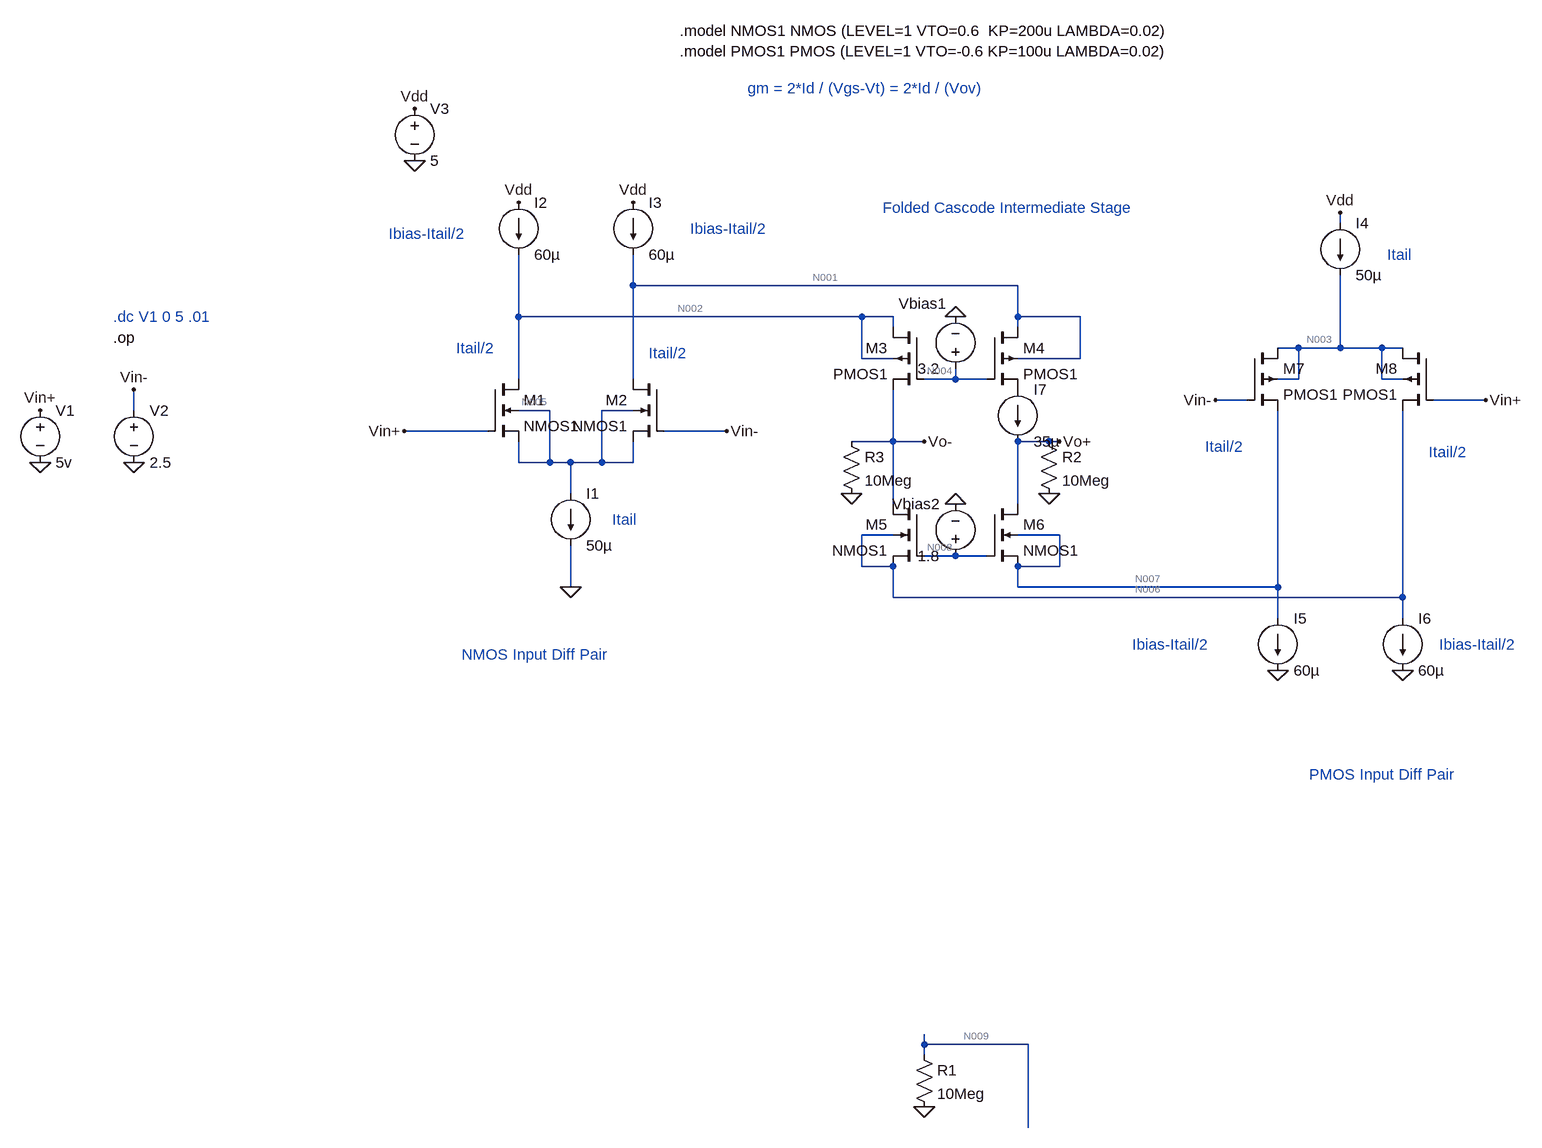
[diagram p0: schematic Mosfet_rail_to_rail_thanksgiving.asc]
Mosfet_rail_to_rail_thanksgiving.asc, the LTspice schematic file:
Version 4.1
SHEET 1 1728 1628
WIRE 1312 -128 1312 -144
WIRE 224 -32 224 -80
WIRE 816 -32 224 -32
WIRE 48 16 48 -80
WIRE 576 16 48 16
WIRE 624 16 576 16
WIRE 816 16 816 -32
WIRE 912 16 816 16
WIRE 624 32 624 16
WIRE 816 32 816 16
WIRE 1248 64 1216 64
WIRE 1312 64 1312 -48
WIRE 1312 64 1248 64
WIRE 1376 64 1312 64
WIRE 1408 64 1376 64
WIRE 576 80 576 16
WIRE 624 80 576 80
WIRE 912 80 912 16
WIRE 912 80 816 80
WIRE 48 112 48 16
WIRE 224 112 224 -32
WIRE 720 112 720 96
WIRE 720 112 672 112
WIRE 768 112 720 112
WIRE 1248 112 1248 64
WIRE 1248 112 1216 112
WIRE 1376 112 1376 64
WIRE 1408 112 1376 112
WIRE 1168 144 1120 144
WIRE 1536 144 1456 144
WIRE -544 160 -544 128
WIRE 96 160 48 160
WIRE 224 160 176 160
WIRE 0 192 -128 192
WIRE 368 192 272 192
WIRE 624 208 624 128
WIRE 624 208 560 208
WIRE 672 208 624 208
WIRE 864 208 816 208
WIRE 880 208 864 208
WIRE 48 240 48 208
WIRE 96 240 96 160
WIRE 96 240 48 240
WIRE 128 240 96 240
WIRE 176 240 176 160
WIRE 176 240 128 240
WIRE 224 240 224 208
WIRE 224 240 176 240
WIRE 128 288 128 240
WIRE 624 304 624 208
WIRE 816 304 816 208
WIRE 624 352 576 352
WIRE 880 352 816 352
WIRE 720 384 672 384
WIRE 768 384 720 384
WIRE 576 400 576 352
WIRE 624 400 576 400
WIRE 880 400 880 352
WIRE 880 400 816 400
WIRE 128 432 128 368
WIRE 816 432 816 400
WIRE 1216 432 1216 160
WIRE 1216 432 816 432
WIRE 624 448 624 400
WIRE 1408 448 1408 160
WIRE 1408 448 624 448
WIRE 1216 480 1216 432
WIRE 1408 480 1408 448
WIRE 672 1136 672 1120
WIRE 832 1136 672 1136
WIRE 672 1152 672 1136
WIRE 832 1264 832 1136
FLAG 128 432 0
FLAG 1216 560 0
FLAG 1408 560 0
FLAG 1536 144 Vin+
FLAG -128 192 Vin+
FLAG 368 192 Vin-
FLAG 1120 144 Vin-
FLAG 720 16 0
FLAG 720 304 0
FLAG -112 -224 0
FLAG -112 -304 Vdd
FLAG 48 -160 Vdd
FLAG 224 -160 Vdd
FLAG 1312 -144 Vdd
FLAG 880 208 Vo+
FLAG -688 240 0
FLAG -688 160 Vin+
FLAG -544 240 0
FLAG -544 128 Vin-
FLAG 672 208 Vo-
FLAG 672 1232 0
FLAG 864 288 0
FLAG 560 288 0
DATAFLAG 1216 272 ""
DATAFLAG 1312 0 ""
DATAFLAG 1408 288 ""
DATAFLAG 400 -32 ""
DATAFLAG 80 16 ""
DATAFLAG 128 272 ""
DATAFLAG 848 208 ""
DATAFLAG 640 208 ""
DATAFLAG 336 192 ""
DATAFLAG -96 192 ""
DATAFLAG 768 1136 ""
SYMBOL nmos4 0 112 R0
SYMATTR InstName M1
SYMATTR Value NMOS1
SYMATTR Value2 l=300n w=300n
SYMBOL nmos4 272 112 M0
SYMATTR InstName M2
SYMATTR Value NMOS1
SYMATTR Value2 l=300n w=300n
SYMBOL current 128 288 R0
WINDOW 123 0 0 Left 0
WINDOW 39 0 0 Left 0
SYMATTR InstName I1
SYMATTR Value 50µ
SYMBOL current 48 -160 R0
WINDOW 123 0 0 Left 0
WINDOW 39 0 0 Left 0
SYMATTR InstName I2
SYMATTR Value 60µ
SYMBOL current 224 -160 R0
WINDOW 123 0 0 Left 0
WINDOW 39 0 0 Left 0
SYMATTR InstName I3
SYMATTR Value 60µ
SYMBOL pmos4 672 32 M0
SYMATTR InstName M3
SYMATTR Value PMOS1
SYMATTR Value2 l=300n w=600n
SYMBOL pmos4 768 32 R0
SYMATTR InstName M4
SYMATTR Value PMOS1
SYMATTR Value2 l=300n w=600n
SYMBOL nmos4 672 304 M0
SYMATTR InstName M5
SYMATTR Value NMOS1
SYMATTR Value2 l=300n w=300n
SYMBOL nmos4 768 304 R0
SYMATTR InstName M6
SYMATTR Value NMOS1
SYMATTR Value2 l=300n w=300n
SYMBOL pmos4 1168 64 R0
SYMATTR InstName M7
SYMATTR Value PMOS1
SYMATTR Value2 l=300n w=600n
SYMBOL pmos4 1456 64 M0
SYMATTR InstName M8
SYMATTR Value PMOS1
SYMATTR Value2 l=300n w=600n
SYMBOL current 1312 -128 R0
WINDOW 123 0 0 Left 0
WINDOW 39 0 0 Left 0
SYMATTR InstName I4
SYMATTR Value 50µ
SYMBOL current 1216 480 R0
WINDOW 123 0 0 Left 0
WINDOW 39 0 0 Left 0
SYMATTR InstName I5
SYMATTR Value 60µ
SYMBOL current 1408 480 R0
WINDOW 123 0 0 Left 0
WINDOW 39 0 0 Left 0
SYMATTR InstName I6
SYMATTR Value 60µ
SYMBOL voltage 720 112 R180
WINDOW 0 14 116 Left 2
WINDOW 3 24 16 Left 2
WINDOW 123 0 0 Left 0
WINDOW 39 0 0 Left 0
SYMATTR InstName Vbias1
SYMATTR Value 3.2
SYMBOL voltage 720 400 R180
WINDOW 0 24 96 Left 2
WINDOW 3 24 16 Left 2
WINDOW 123 0 0 Left 0
WINDOW 39 0 0 Left 0
SYMATTR InstName Vbias2
SYMATTR Value 1.8
SYMBOL voltage -112 -320 R0
WINDOW 123 0 0 Left 0
WINDOW 39 0 0 Left 0
SYMATTR InstName V3
SYMATTR Value 5
SYMBOL voltage -688 144 R0
WINDOW 123 0 0 Left 0
WINDOW 39 0 0 Left 0
SYMATTR InstName V1
SYMATTR Value 5v
SYMBOL voltage -544 144 R0
WINDOW 123 0 0 Left 0
WINDOW 39 0 0 Left 0
SYMATTR InstName V2
SYMATTR Value 2.5
SYMBOL res 656 1136 R0
SYMATTR InstName R1
SYMATTR Value 10Meg
SYMBOL res 848 192 R0
SYMATTR InstName R2
SYMATTR Value 10Meg
SYMBOL current 816 128 R0
WINDOW 123 0 0 Left 0
WINDOW 39 0 0 Left 0
SYMATTR InstName I7
SYMATTR Value 35µ
SYMBOL res 544 192 R0
SYMATTR InstName R3
SYMATTR Value 10Meg
TEXT 192 328 Left 2 ;Itail
TEXT -48 64 Left 2 ;Itail/2
TEXT 248 72 Left 2 ;Itail/2
TEXT 1104 216 Left 2 ;Itail/2
TEXT 1448 224 Left 2 ;Itail/2
TEXT 1384 -80 Left 2 ;Itail
TEXT -152 -112 Left 2 ;Ibias-Itail/2
TEXT 312 -120 Left 2 ;Ibias-Itail/2
TEXT 992 520 Left 2 ;Ibias-Itail/2
TEXT 1464 520 Left 2 ;Ibias-Itail/2
TEXT 400 -336 Left 2 ;gm = 2*Id / (Vgs-Vt) = 2*Id / (Vov)
TEXT 296 -424 Left 2 !.model NMOS1 NMOS (LEVEL=1 VTO=0.6  KP=200u LAMBDA=0.02)\n.model PMOS1 PMOS (LEVEL=1 VTO=-0.6 KP=100u LAMBDA=0.02)
TEXT -576 16 Left 2 ;.dc V1 0 5 .01
TEXT -576 48 Left 2 !.op
TEXT -40 536 Left 2 ;NMOS Input Diff Pair
TEXT 1264 720 Left 2 ;PMOS Input Diff Pair
TEXT 608 -152 Left 2 ;Folded Cascode Intermediate Stage

The netlist it stands for:
* Mosfet_rail_to_rail_thanksgiving.asc
M1 N002 Vin+ N005 N005 NMOS1 l=300n w=300n
M2 N001 Vin- N005 N005 NMOS1 l=300n w=300n
I1 N005 0 50µ
I2 Vdd N002 60µ
I3 Vdd N001 60µ
M3 N002 N004 Vo- N002 PMOS1 l=300n w=600n
M4 N001 N004 P001 N001 PMOS1 l=300n w=600n
M5 Vo- N008 N006 N006 NMOS1 l=300n w=300n
M6 Vo+ N008 N007 N007 NMOS1 l=300n w=300n
M7 N003 Vin- N007 N003 PMOS1 l=300n w=600n
M8 N003 Vin+ N006 N003 PMOS1 l=300n w=600n
I4 Vdd N003 50µ
I5 N007 0 60µ
I6 N006 0 60µ
Vbias1 N004 0 3.2
Vbias2 N008 0 1.8
V3 Vdd 0 5
V1 Vin+ 0 5v
V2 Vin- 0 2.5
R1 N009 0 10Meg
R2 Vo+ 0 10Meg
I7 P001 Vo+ 35µ
R3 Vo- 0 10Meg
.model NMOS NMOS
.model PMOS PMOS
.lib standard.mos
* Itail
* Itail/2
* Itail/2
* Itail/2
* Itail/2
* Itail
* Ibias-Itail/2
* Ibias-Itail/2
* Ibias-Itail/2
* Ibias-Itail/2
* gm = 2*Id / (Vgs-Vt) = 2*Id / (Vov)
.model NMOS1 NMOS (LEVEL=1 VTO=0.6  KP=200u LAMBDA=0.02)
.model PMOS1 PMOS (LEVEL=1 VTO=-0.6 KP=100u LAMBDA=0.02)
* .dc V1 0 5 .01
.op
* NMOS Input Diff Pair
* PMOS Input Diff Pair
* Folded Cascode Intermediate Stage
.backanno
.end

* Results of the author's LTspice run, read from the files saved beside the schematic
* Operating Point:
*   V(n001) = 13.74 MV
*   V(n002) = 4.059 V
*   V(n003) = 3.789 V
*   V(n004) = 3.2 V
*   V(n005) = 3.817 V
*   V(n006) = -225.1 V
*   V(n007) = 1.071 V
*   V(n008) = 1.8 V
*   V(n009) = 0 V
*   V(p001) = 13.74 MV
*   V(vdd) = 5 V
*   V(vin+) = 5 V
*   V(vin-) = 2.5 V
*   V(vo+) = 250 V
*   V(vo-) = -225.1 V
*   I(I1) = 50 µA
*   I(I2) = 60 µA
*   I(I3) = 60 µA
*   I(I4) = 50 µA
*   I(I5) = 60 µA
*   I(I6) = 60 µA
*   I(I7) = 35 µA
*   I(R1) = 0 A
*   I(R2) = 25 µA
*   I(R3) = -22.51 µA
*   I(V1) = 0 A
*   I(V2) = 0 A
*   I(V3) = -170 µA
*   I(Vbias1) = 0 A
*   I(Vbias2) = 0 A
*   Ib(M1) = -252.4 fA
*   Ib(M2) = -13.74 µA
*   Ib(M3) = 229.2 pA
*   Ib(M4) = 0 A
*   Ib(M5) = -1.825 fA
*   Ib(M6) = -248.9 pA
*   Ib(M7) = 2.728 pA
*   Ib(M8) = 228.9 pA
*   Id(M1) = 22.51 µA
*   Id(M2) = 27.49 µA
*   Id(M3) = 37.49 µA
*   Id(M4) = 30.72 µA
*   Id(M5) = 60 µA
*   Id(M6) = 10 µA
*   Id(M7) = 50 µA
*   Id(M8) = 228.9 pA
*   Ig(M1) = 0 A
*   Ig(M2) = 0 A
*   Ig(M3) = 0 A
*   Ig(M4) = 0 A
*   Ig(M5) = 0 A
*   Ig(M6) = 0 A
*   Ig(M7) = 0 A
*   Ig(M8) = 0 A
*   Is(M1) = -22.51 µA
*   Is(M2) = -13.74 µA
*   Is(M3) = -37.49 µA
*   Is(M4) = -30.72 µA
*   Is(M5) = -60 µA
*   Is(M6) = -10 µA
*   Is(M7) = -50 µA
*   Is(M8) = -457.8 pA